# Altium schematic sheet Holoboard_motor_interface.SchDoc
size A3
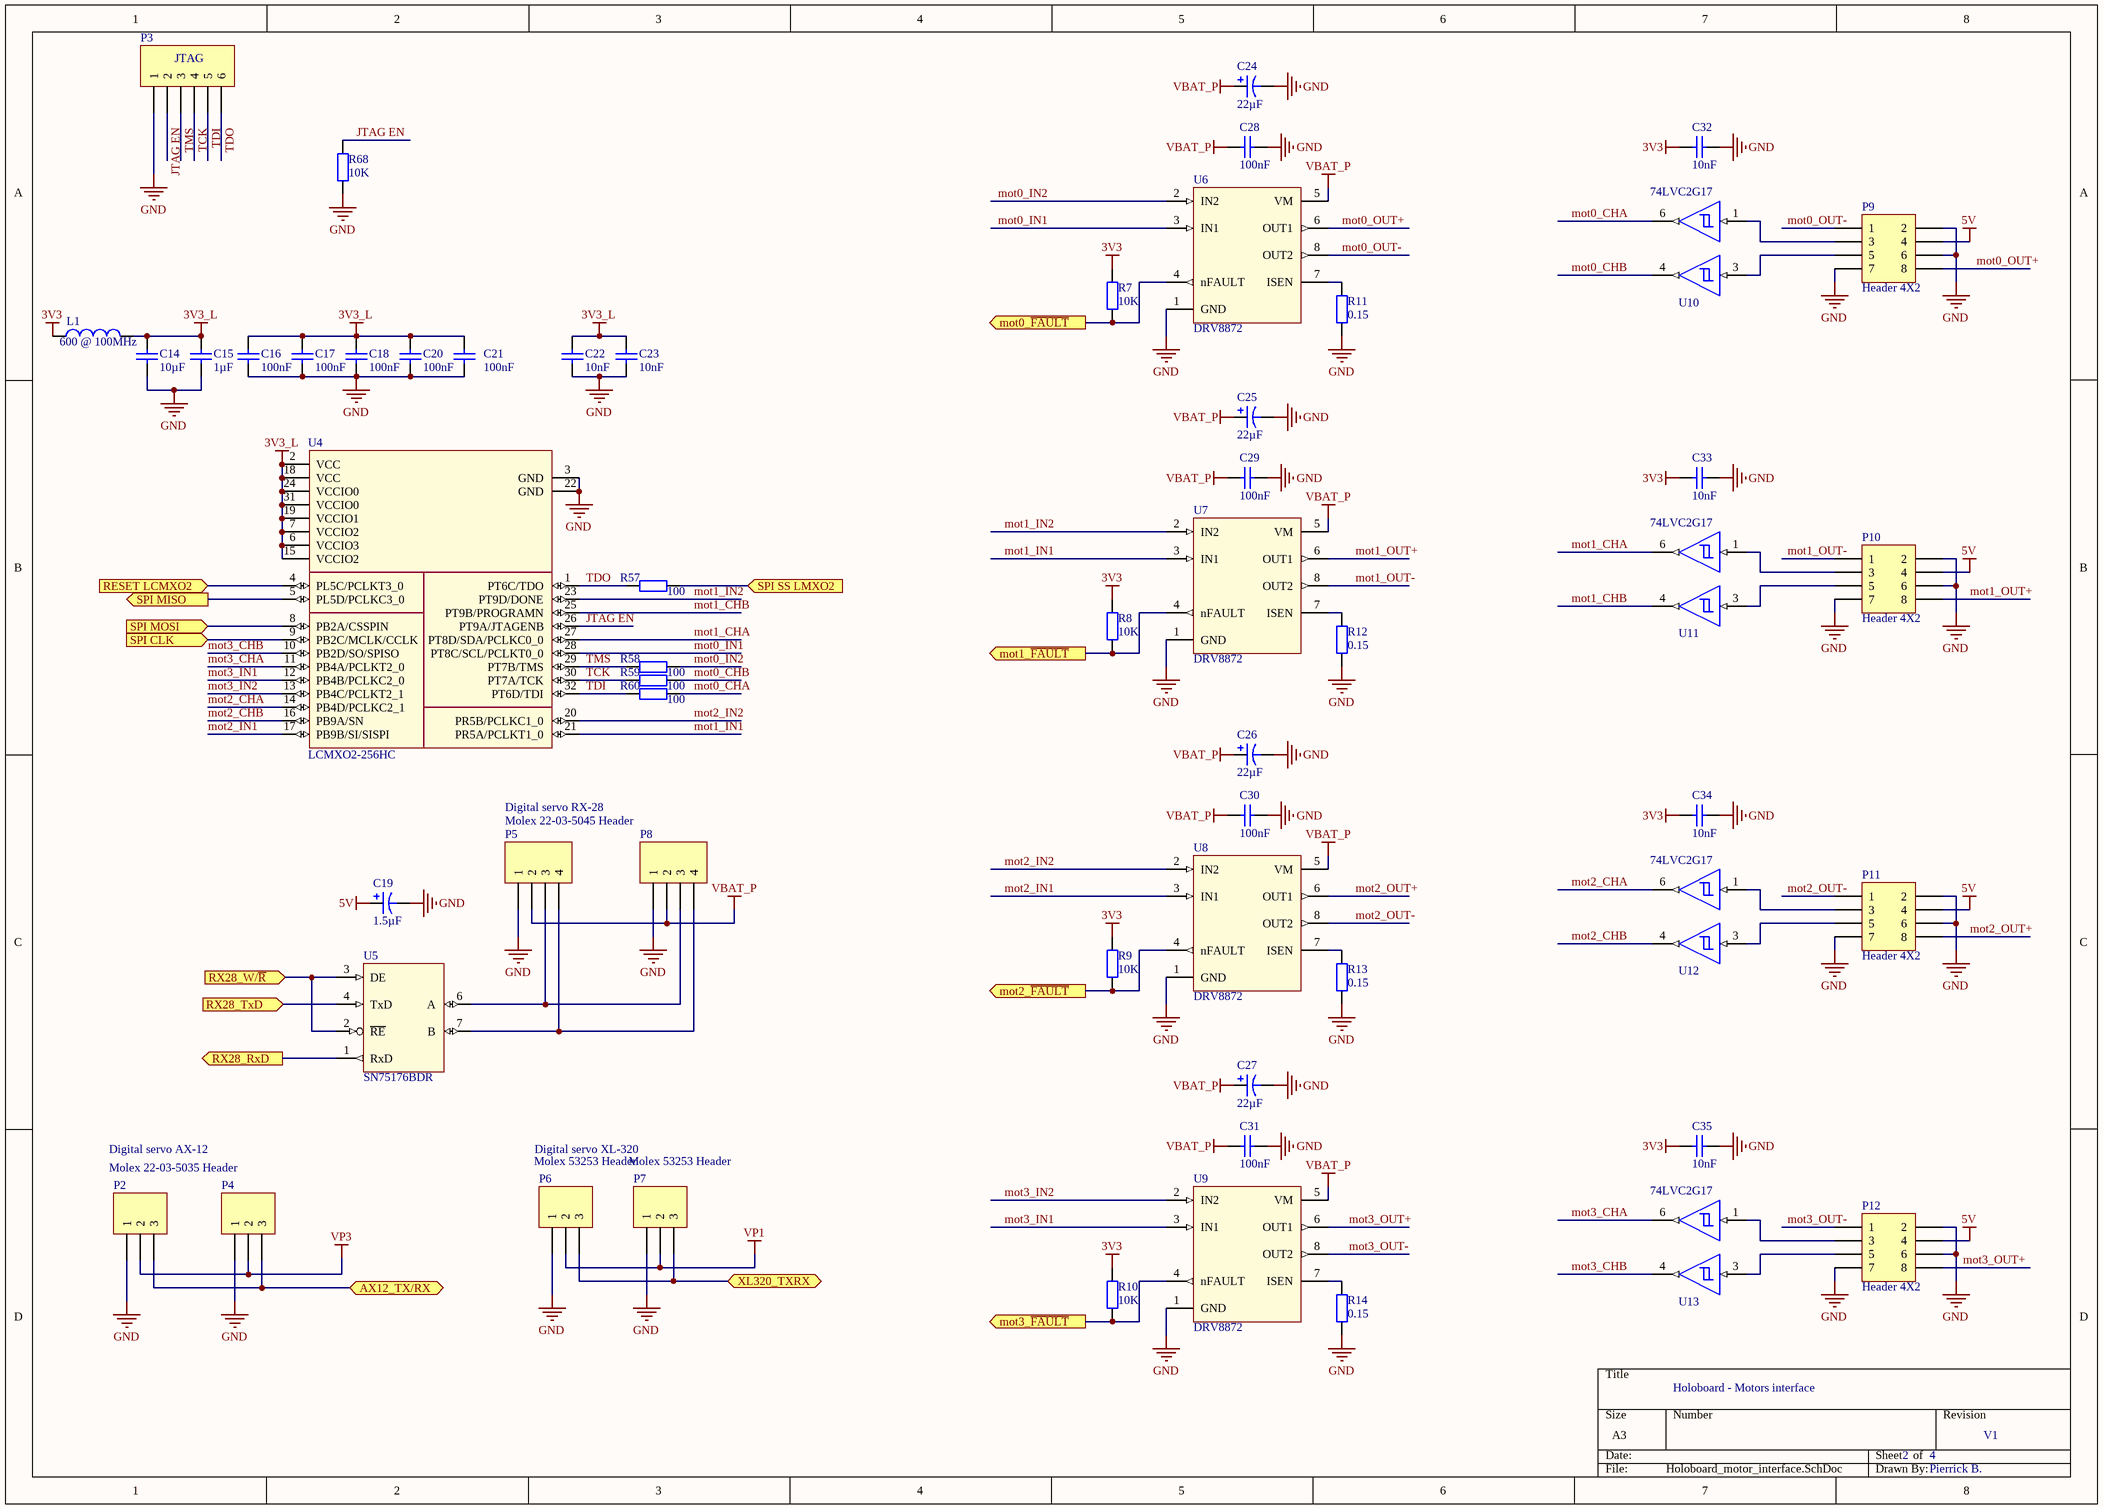
[diagram p0: Holoboard_motor_interface.SchDoc]

## Parts
C14  value 10µF  [C0805]  (hidden comment: Cap)
C15  value 1µF  [C0603]  (hidden comment: Cap)
C16  value 100nF  [C0603]  (hidden comment: Cap)
C17  value 100nF  [C0603]  (hidden comment: Cap)
C18  value 100nF  [C0603]  (hidden comment: Cap)
C19  value 1.5µF  [Boitier tantale A]  (hidden comment: Cap Pol)
C20  value 100nF  [C0603]  (hidden comment: Cap)
C21  value 100nF  [C0603]  (hidden comment: Cap)
C22  value 10nF  [C0603]  (hidden comment: Cap)
C23  value 10nF  [C0603]  (hidden comment: Cap)
C24  value 22µF  [Boitier tantale B]  (hidden comment: Cap Pol)
C25  value 22µF  [Boitier tantale B]  (hidden comment: Cap Pol)
C26  value 22µF  [Boitier tantale B]  (hidden comment: Cap Pol)
C27  value 22µF  [Boitier tantale B]  (hidden comment: Cap Pol)
C28  value 100nF  [C0603]  (hidden comment: Cap)
C29  value 100nF  [C0603]  (hidden comment: Cap)
C30  value 100nF  [C0603]  (hidden comment: Cap)
C31  value 100nF  [C0603]  (hidden comment: Cap)
C32  value 10nF  [C0603]  (hidden comment: Cap)
C33  value 10nF  [C0603]  (hidden comment: Cap)
C34  value 10nF  [C0603]  (hidden comment: Cap)
C35  value 10nF  [C0603]  (hidden comment: Cap)
L1  value 600 @ 100MHz  [0805]  (hidden comment: Inductor)
P2  Molex 22-03-5035 Header  [22-03-5035]
P3  JTAG  [minitek127-6way]
P4  Molex 22-03-5035 Header  [22-03-5035]  (value not drawn)
P5  Molex 22-03-5045 Header  [22-03-5045]
P6  Molex 53253 Header  [53253-0370]
P7  Molex 53253 Header  [53253-0370]
P8  Header 4  [22-03-5045]  (value not drawn)
P9  Header 4X2  [114-15030]
P10  Header 4X2  [114-15030]
P11  Header 4X2  [114-15030]
P12  Header 4X2  [114-15030]
R7  value 10K  [0603]  (hidden comment: Res2)
R8  value 10K  [0603]  (hidden comment: Res2)
R9  value 10K  [0603]  (hidden comment: Res2)
R10  value 10K  [0603]  (hidden comment: Res2)
R11  value 0.15  [2510]  (hidden comment: Res2)
R12  value 0.15  [2510]  (hidden comment: Res2)
R13  value 0.15  [2510]  (hidden comment: Res2)
R14  value 0.15  [2510]  (hidden comment: Res2)
R57  value 100  [0603]  (hidden comment: Res2)
R58  value 100  [0603]  (hidden comment: Res2)
R59  value 100  [0603]  (hidden comment: Res2)
R60  value 100  [0603]  (hidden comment: Res2)
R68  value 10K  [0603]  (hidden comment: Res2)
U4  LCMXO2-256HC  [QFN32]
U5  SN75176BDR  [SOIC150-8]
U6  DRV8872  [DDA]
U7  DRV8872  [DDA]
U8  DRV8872  [DDA]
U9  DRV8872  [DDA]
U10  74LVC2G17  [SOT457]
U11  74LVC2G17  [SOT457]
U12  74LVC2G17  [SOT457]
U13  74LVC2G17  [SOT457]

## Ports
AX12_TX/RX (bidir), mot0_~{FAULT} (out), mot1_~{FAULT} (out), mot2_~{FAULT} (out), mot3_~{FAULT} (out), RESET LCMXO2 (in), RX28_RxD (out), RX28_TxD (in), RX28_W/~{R} (in), SPI CLK (in), SPI MISO (out), SPI MOSI (in), SPI SS LMXO2 (in), XL320_TXRX (bidir)

## Nets
3V3: C32.1 C33.1 C34.1 C35.1 L1.1 R7.2 R8.2 R9.2 R10.2 U10.5(Vcc) U11.5(Vcc) U12.5(Vcc) U13.5(Vcc)
3V3_L: C14.2 C15.2 C16.2 C17.2 C18.2 C20.2 C21.2 C22.2 C23.2 L1.2 U4.2(VCC) U4.6(VCCIO3) U4.7(VCCIO2) U4.15(VCCIO2) U4.18(VCC) U4.19(VCCIO1) U4.24(VCCIO0) U4.31(VCCIO0)
5V: C19.1 P9.4 P10.4 P11.4 P12.4 U5.8(VCC)
GND: C14.1 C15.1 C16.1 C17.1 C18.1 C19.2 C20.1 C21.1 C22.1 C23.1 C24.2 C25.2 C26.2 C27.2 C28.2 C29.2 C30.2 C31.2 C32.2 C33.2 C34.2 C35.2 P2.1 P3.1 P4.1 P5.1 P6.1 P7.1 P8.1 P9.2 P9.6 P9.7 P10.2 P10.6 P10.7 P11.2 P11.6 P11.7 P12.2 P12.6 P12.7 R11.1 R12.1 R13.1 R14.1 R68.2 U4.3(GND) U4.22(GND) U5.5(GND) U6.1(GND) U6.PPAD U7.1(GND) U7.PPAD U8.1(GND) U8.PPAD U9.1(GND) U9.PPAD U10.2(GND) U11.2(GND) U12.2(GND) U13.2(GND)
VBAT_P: C24.1 C25.1 C26.1 C27.1 C28.1 C29.1 C30.1 C31.1 P5.2 P8.2 U6.5(VM) U7.5(VM) U8.5(VM) U9.5(VM)
VP1: P6.2 P7.2
VP3: P2.2 P4.2
AX12_TX/RX: P2.3 P4.3 ; port AX12_TX/RX
JTAG EN: P3.2 R68.1 U4.26(PT9A/JTAGENB)
mot0_CHA: R60.1 U10.6(1Y)
mot0_CHB: R59.1 U10.4(2Y)
mot0_~{FAULT}: R7.1 U6.4(nFAULT) ; port mot0_~{FAULT}
mot0_IN1: U4.28(PT8C/SCL/PCLKT0_0) U6.3(IN1)
mot0_IN2: R58.1 U6.2(IN2)
mot0_OUT+: P9.8 U6.6(OUT1)
mot0_OUT-: P9.1 U6.8(OUT2)
mot1_CHA: U4.27(PT8D/SDA/PCLKC0_0) U11.6(1Y)
mot1_CHB: U4.25(PT9B/PROGRAMN) U11.4(2Y)
mot1_~{FAULT}: R8.1 U7.4(nFAULT) ; port mot1_~{FAULT}
mot1_IN1: U4.21(PR5A/PCLKT1_0) U7.3(IN1)
mot1_IN2: U4.23(PT9D/DONE) U7.2(IN2)
mot1_OUT+: P10.8 U7.6(OUT1)
mot1_OUT-: P10.1 U7.8(OUT2)
mot2_CHA: U4.14(PB4D/PCLKC2_1) U12.6(1Y)
mot2_CHB: U4.16(PB9A/SN) U12.4(2Y)
mot2_~{FAULT}: R9.1 U8.4(nFAULT) ; port mot2_~{FAULT}
mot2_IN1: U4.17(PB9B/SI/SISPI) U8.3(IN1)
mot2_IN2: U4.20(PR5B/PCLKC1_0) U8.2(IN2)
mot2_OUT+: P11.8 U8.6(OUT1)
mot2_OUT-: P11.1 U8.8(OUT2)
mot3_CHA: U4.11(PB4A/PCLKT2_0) U13.6(1Y)
mot3_CHB: U4.10(PB2D/SO/SPISO) U13.4(2Y)
mot3_~{FAULT}: R10.1 U9.4(nFAULT) ; port mot3_~{FAULT}
mot3_IN1: U4.12(PB4B/PCLKC2_0) U9.3(IN1)
mot3_IN2: U4.13(PB4C/PCLKT2_1) U9.2(IN2)
mot3_OUT+: P12.8 U9.6(OUT1)
mot3_OUT-: P12.1 U9.8(OUT2)
RESET LCMXO2: U4.4(PL5C/PCLKT3_0) ; port RESET LCMXO2
RX28_RxD: U5.1(RxD) ; port RX28_RxD
RX28_TxD: U5.4(TxD) ; port RX28_TxD
RX28_W/~{R}: U5.2(~{RE}) U5.3(DE) ; port RX28_W/~{R}
SPI CLK: U4.9(PB2C/MCLK/CCLK) ; port SPI CLK
SPI MISO: U4.5(PL5D/PCLKC3_0) ; port SPI MISO
SPI MOSI: U4.8(PB2A/CSSPIN) ; port SPI MOSI
SPI SS LMXO2: R57.1 ; port SPI SS LMXO2
TCK: P3.4 R59.2 U4.30(PT7A/TCK)
TDI: P3.5 R60.2 U4.32(PT6D/TDI)
TDO: P3.6 R57.2 U4.1(PT6C/TDO)
TMS: P3.3 R58.2 U4.29(PT7B/TMS)
XL320_TXRX: P6.3 P7.3 ; port XL320_TXRX
NetP5_3: P5.3 P8.3 U5.6(A)
NetP5_4: P5.4 P8.4 U5.7(B)
NetP9_3: P9.3 U10.1(1A)
NetP9_5: P9.5 U10.3(2A)
NetP10_3: P10.3 U11.1(1A)
NetP10_5: P10.5 U11.3(2A)
NetP11_3: P11.3 U12.1(1A)
NetP11_5: P11.5 U12.3(2A)
NetP12_3: P12.3 U13.1(1A)
NetP12_5: P12.5 U13.3(2A)
NetR11_2: R11.2 U6.7(ISEN)
NetR12_2: R12.2 U7.7(ISEN)
NetR13_2: R13.2 U8.7(ISEN)
NetR14_2: R14.2 U9.7(ISEN)

## Notes on the sheet
- Digital servo RX-28
- Digital servo AX-12
- Digital servo XL-320
- Holoboard - Motors interface
- 2
- 4
- V1
- Pierrick B.

## Library data of the parts
C14-C18 C20-C23 C28-C35 = Cap: Capacitor; Published: 8-Jun-2000; LatestRevisionDate: 17-Jul-2002; LatestRevisionNote: Re-released for DXP Platform.; PackageReference: RAD-0.3; Publisher: Altium Limited; Supplier: FARNELL
C19 C24-C27 = Cap Pol: Polarized Capacitor; Published: 8-Jun-2000; LatestRevisionDate: 17-Jul-2002; LatestRevisionNote: Re-released for DXP Platform.; PackageReference: POLAR0.8; Publisher: Altium Limited; Supplier: FARNELL
L1 = Inductor: Code_IEC: 1005; Published: 8-Jun-2000; LatestRevisionDate: 17-Jul-2002; LatestRevisionNote: Re-released for DXP Platform.; PackageReference: 0402-A; Publisher: Altium Limited; Code_JEITA: 0402
P2 P4 P6 P7 = Header 3: Header, 3-Pin; LatestRevisionDate: 17-Jul-2002; LatestRevisionNote: Re-released for DXP Platform.; Publisher: Altium Limited
P3 = Header 6: Header, 6-Pin; Supplie: FARNELL
P5 P8 = Header 4: Header, 4-Pin; LatestRevisionDate: 17-Jul-2002; LatestRevisionNote: Re-released for DXP Platform.; Publisher: Altium Limited
P9-P12 = Header 4X2: Header, 4-Pin, Dual row; LatestRevisionDate: 17-Jul-2002; LatestRevisionNote: Re-released for DXP Platform.; Publisher: Altium Limited
R7-R14 R57-R60 R68 = Res2: Resistor; Published: 8-Jun-2000; LatestRevisionDate: 17-Jul-2002; LatestRevisionNote: Re-released for DXP Platform.; PackageReference: AXIAL-0.4; Publisher: Altium Limited; Supplier: FARNELL
U6-U9 = DRV8872: 3.6A Brushed  DC Motor  Driver  With Fault Reporting
U10-U13 = 74LVC2G17: Dual non-inverting Schmitt trigger with 5 V tolerant input